# Altium schematic sheet FC_Sheet3_Sensors.SchDoc
size A4; SheetNumber: 3; SheetTotal: 3
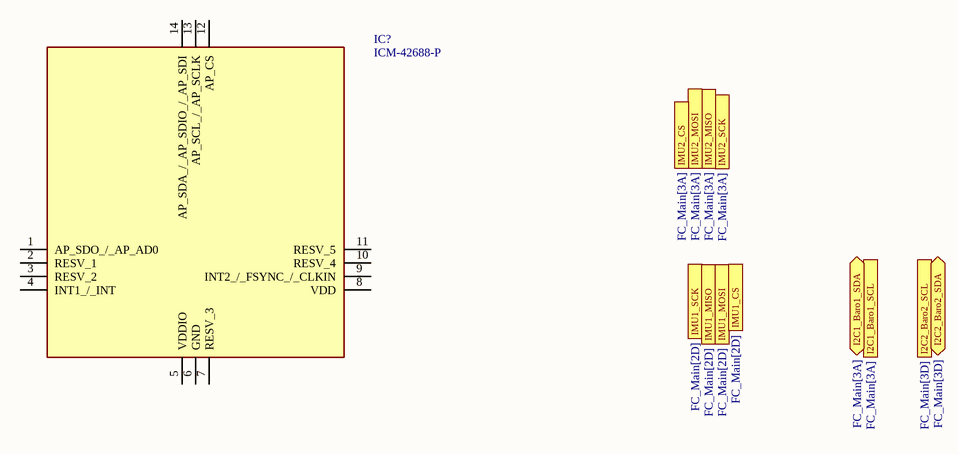
[diagram p0: FC_Sheet3_Sensors.SchDoc]

## Parts
IC?  ICM-42688-P  [IIM42352]

## Ports
I2C1_Baro1_SCL (in, see FC_Main[3A]), I2C1_Baro1_SDA (bidir, see FC_Main[3A]), I2C2_Baro2_SCL (in, see FC_Main[3D]), I2C2_Baro2_SDA (bidir, see FC_Main[3D]), IMU1_CS (in, see FC_Main[2D]), IMU1_MISO (out, see FC_Main[2D]), IMU1_MOSI (in, see FC_Main[2D]), IMU1_SCK (in, see FC_Main[2D]), IMU2_CS (in, see FC_Main[3A]), IMU2_MISO (out, see FC_Main[3A]), IMU2_MOSI (in, see FC_Main[3A]), IMU2_SCK (in, see FC_Main[3A])

## Nets

Not connected (* = marked no-connect by the designer): IC? 1(AP_SDO_/_AP_AD0) 2(RESV_1) 3(RESV_2) 4(INT1_/_INT) 5(VDDIO) 6(GND) 7(RESV_3) 8(VDD) 9(INT2_/_FSYNC_/_CLKIN) 10(RESV_4) 11(RESV_5) 12(AP_CS) 13(AP_SCL_/_AP_SCLK) 14(AP_SDA_/_AP_SDIO_/_AP_SDI)

## Library data of the parts
IC? = ICM-42688-P: Integrated Circuit; Manufacturer_Name: TDK; Datasheet Link: https://3cfeqx1hf82y3xcoull08ihx-wpengine.netdna-ssl.com/wp-content/uploads/2021/06/DS-000347-ICM-42688-P-v1.5.pdf; Manufacturer_Part_Number: ICM-42688-P; Mouser Part Number: 410-ICM-42688-P; Mouser Price/Stock: https://www.mouser.co.uk/ProductDetail/TDK-InvenSense/ICM-42688-P?qs=OlC7AqGiEDk8QrNAV728zw%3D%3D; Arrow Part Number: ICM-42688-P; Arrow Price/Stock: https://www.arrow.com/en/products/icm-42688-p/invensense?utm_currency=USD&region=nac